# EasyEDA schematic SCH_AP4_HWI_diagram.json
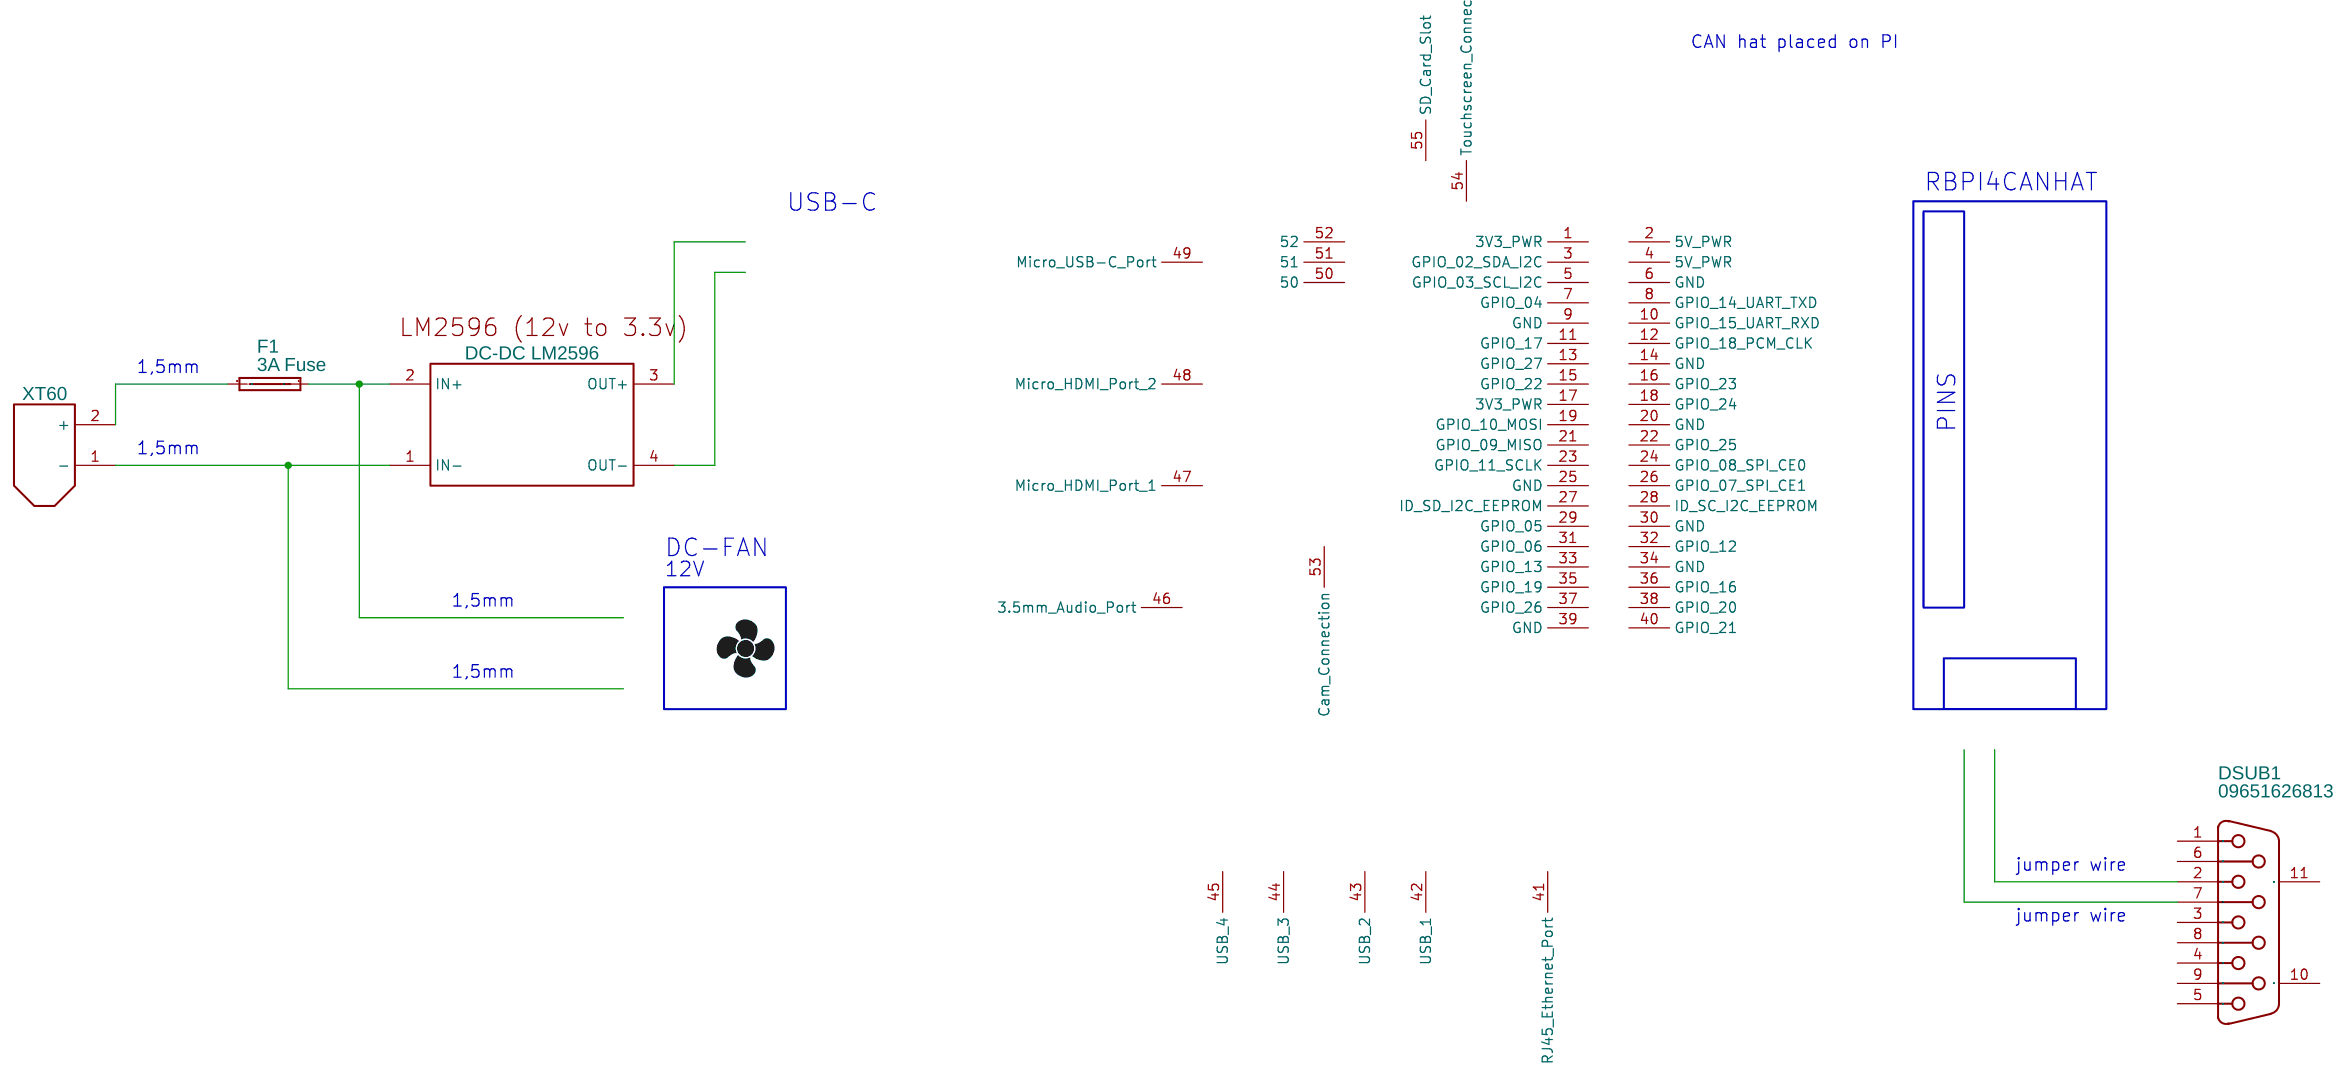
[diagram p0: schematic sheet]

## Parts
B1  DC-DC LM2596  [LM2596]
DSUB1  09651626813  [D-SUB-TH_0965162681]
F1  3A Fuse  [FUSE-HOLDER-WITH-COVER-FOR-5X20MM-FUSE_FOOTPRINT]
NO1  XT60  [XT60]
RASPBERRYPI4  Raspberry Pi 4  [RASBERRYPI4PCBLIB]

## Library data of the parts
B1 = DC-DC LM2596: Manufacturer Part: New SchematicLib; Contributor: pandualansumardisiagian
DSUB1 = 09651626813: Contributor: LCSC; Supplier: LCSC; Supplier Part: C698274; Manufacturer: Harting(浩亭); JLCPCB Part Class: Extended Part; link: https://lcsc.com/eda_search?q=C698274&%26type=1&ref=editor
F1 = FUSE HOLDER WITH COVER FOR 5X20MM FUSE: Contributor: rugved
NO1 = XT60: Manufacturer: AMASS; Supplier: AMASS; Contributor: dinul

## Nets
Net-(B1-1): B1.1(IN-) NO1.1(-)
Net-(B1-2): B1.2(IN+) F1.1
Net-(F1-2): F1.2 NO1.2(+)

Not connected (* = marked no-connect by the designer): B1 3(OUT+) 4(OUT-); DSUB1 1 2 3 4 5 6 7 8 9 10(MH1) 11(MH2); RASPBERRYPI4 1(3V3 PWR) 2(5V PWR) 3(GPIO 02 SDA I2C) 4(5V PWR) 5(GPIO 03 SCL I2C) 6(GND) 7(GPIO 04) 8(GPIO 14 UART TXD) 9(GND) 10(GPIO 15 UART RXD) 11(GPIO 17) 12(GPIO 18 PCM CLK) 13(GPIO 27) 14(GND) 15(GPIO 22) 16(GPIO 23) 17(3V3 PWR) 18(GPIO 24) 19(GPIO 10 MOSI) 20(GND) 21(GPIO 09 MISO) 22(GPIO 25) 23(GPIO 11 SCLK) 24(GPIO 08 SPI CE0) 25(GND) 26(GPIO 07 SPI CE1) 27(ID_SD I2C EEPROM) 28(ID_SC I2C EEPROM) 29(GPIO 05) 30(GND) 31(GPIO 06) 32(GPIO 12) 33(GPIO 13) 34(GND) 35(GPIO 19) 36(GPIO 16) 37(GPIO 26) 38(GPIO 20) 39(GND) 40(GPIO 21) 41(RJ45 Ethernet Port) 42(USB 1) 43(USB 2) 44(USB 3) 45(USB 4) 46(3.5mm Audio Port) 47(Micro HDMI Port 1) 48(Micro HDMI Port 2) 49(Micro USB-C Port) 50 51 52 53(Cam Connection) 54(Touchscreen Connection) 55(SD Card Slot)

## Notes on the sheet
- CAN hat placed on PI
- RBPI4CANHAT
- USB-C
- 1,5mm
- 1,5mm
- PINS
- DC-FAN
- 12V
- 1,5mm
- 1,5mm
- jumper wire
- jumper wire
